# Altium schematic sheet S07.SchDoc: Quad Linear Amplifier
size 381 x 254 mm; Revision: 1.6; SheetNumber: 7; SheetTotal: 9
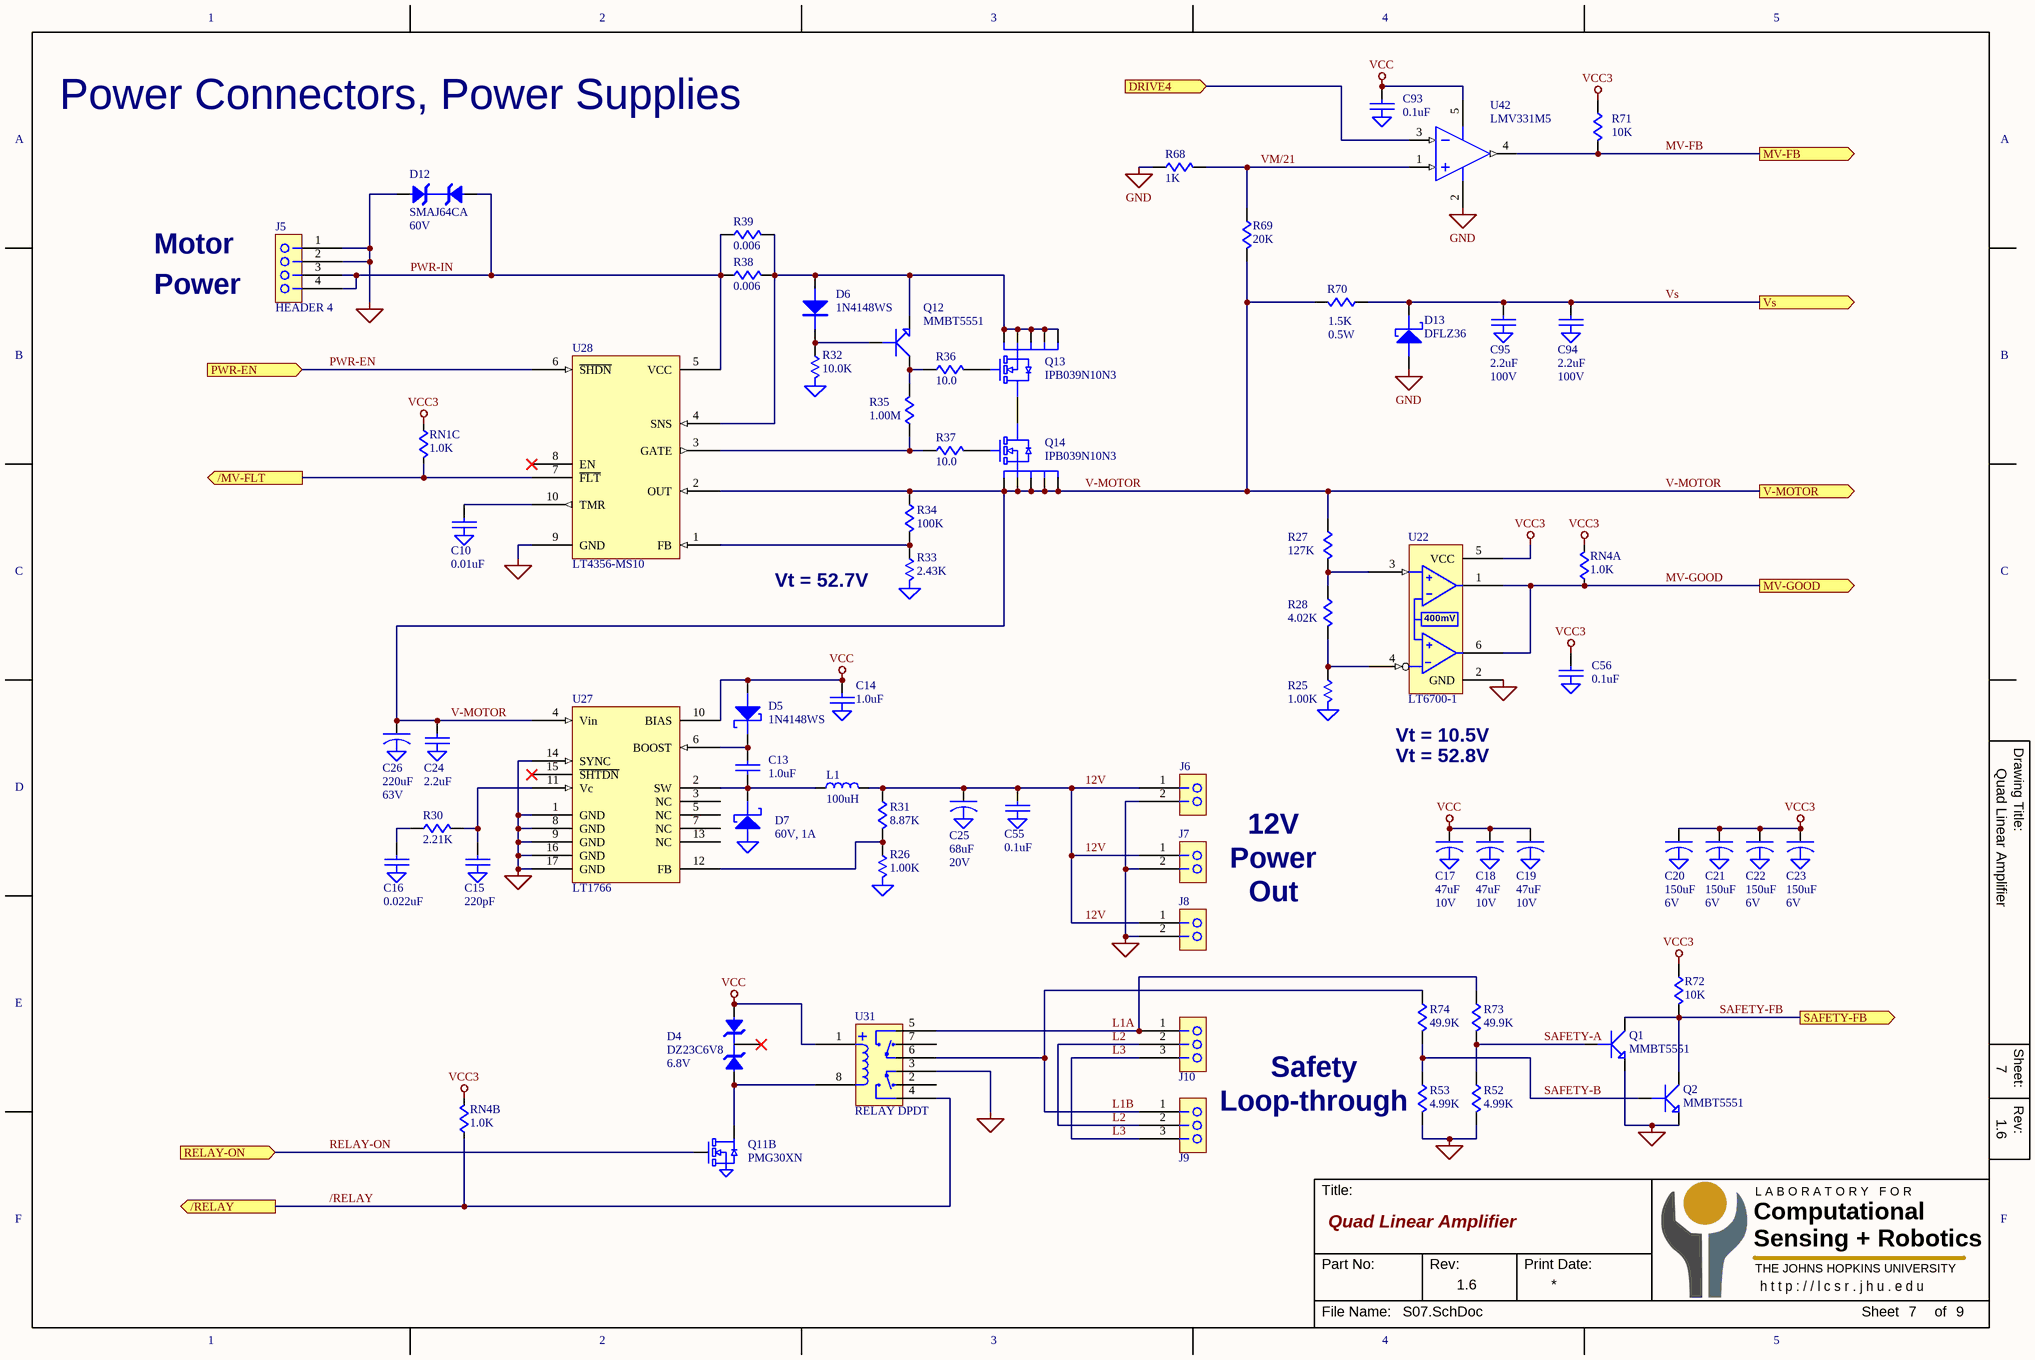
[diagram p0: S07.SchDoc]

## Parts
C10  0.01uF  [C0603]
C13  1.0uF  [C0603]
C14  1.0uF  [C0603]
C15  220pF  [C0603]
C16  0.022uF  [C0603]
C17  47uF  Voltage: 10V  [CAP-B]
C18  47uF  Voltage: 10V  [CAP-B]
C19  47uF  Voltage: 10V  [CAP-B]
C20  150uF  Voltage: 6V  [CAP-B]
C21  150uF  Voltage: 6V  [CAP-B]
C22  150uF  Voltage: 6V  [CAP-B]
C23  150uF  Voltage: 6V  [CAP-B]
C24  2.2uF  [C1206]
C25  68uF  Voltage: 20V  [CAP-D-43]
C26  220uF  Voltage: 63V  [CAP-10MM]
C55  0.1uF  [C0603]
C56  0.1uF  [C0603]
C93  0.1uF  [C0603]
C94  2.2uF  Voltage: 100V  [C1206]
C95  2.2uF  Voltage: 100V  [C1206]
D4  DZ23C6V8  Voltage: 6.8V  [SOT-23]
D5  1N4148WS  [SOD-323]
D6  1N4148WS  [SOD-323]
D7  60V, 1A  [SMP]
D12  SMAJ64CA  Voltage: 60V  [SMA]
D13  DFLZ36  [PowerDI-123]
J5  HEADER 4  [WM-BL381-4]
J6  HEADER 2  [HDR-2x1-100]  (value not drawn)
J7  HEADER 2  [HDR-2x1-100]  (value not drawn)
J8  HEADER 2  [HDR-2x1-100]  (value not drawn)
J9  HEADER 3  [HDR-3x1-100]  (value not drawn)
J10  HEADER 3  [HDR-3x1-100]  (value not drawn)
L1  100uH  [INDUCTOR-DR12x]
Q1  MMBT5551  [SOT-23]
Q2  MMBT5551  [SOT-23]
Q11  PMG30XN  [SC70-6]  (part B of 2)
Q12  MMBT5551  [SOT-23]
Q13  IPB039N10N3  [TO-263-7]
Q14  IPB039N10N3  [TO-263-7]
R25  1.00K  [R0603]
R26  1.00K  [R0603]
R27  127K  [R0603]
R28  4.02K  [R0603]
R30  2.21K  [R0603]
R31  8.87K  [R0603]
R32  10.0K  [R0603]
R33  2.43K  [R0603]
R34  100K  [R0603]
R35  1.00M  [R0603]
R36  10.0  [R0603]
R37  10.0  [R0603]
R38  0.006  [R2512]
R39  0.006  [R2512]
R52  4.99K  [R0603]
R53  4.99K  [R0603]
R68  1K  [R0603]
R69  20K  [R0603]
R70  1.5K  Power: 0.5W  [R0805]
R71  10K  [R0603]
R72  10K  [R0603]
R73  49.9K  [R0603]
R74  49.9K  [R0603]
RN1  1.0K  [RN-742C083]  (part C of 4)
RN4  1.0K  [RN-742C083]  (parts A,B of 4)
U22  LT6700-1  [SOT-23-6]
U27  LT1766  [TSSOP-17]
U28  LT4356-MS10  [MSOP-10]
U31  RELAY DPDT  [RELAY-IM03TS]
U42  LMV331M5  [SOT-23-5]

## Ports
/MV-FLT (out), /RELAY (out), DRIVE4 (in), MV-FB (out), MV-GOOD (out), PWR-EN (in), RELAY-ON (in), SAFETY-FB (out), V-MOTOR (out), Vs (out)

## Nets
GND: C10.2(GND) C14.2(GND) C15.2(GND) C16.2(GND) C17.2(GND) C18.2(GND) C19.2(GND) C20.2(GND) C21.2(GND) C22.2(GND) C23.2(GND) C24.2(GND) C25.2(GND) C26.2(GND) C55.2(GND) C56.2(GND) C93.2(GND) C94.2(GND) C95.2(GND) D7.2(ANODE) D12.2(A1) D13.2(ANODE) J5.1 J5.2 J6.2 J7.2 J8.2 Q1.2(E) Q2.2(E) Q11.4(S2) R25.2(GND) R26.2(GND) R32.2(GND) R33.2(GND) R52.2 R53.2 R68.1 U22.2(GND) U27.1(GND) U27.8(GND) U27.9(GND) U27.14(SYNC) U27.16(GND) U27.17(GND) U28.9(GND) U31.3(COM) U42.2(V-)
VCC: C14.1 C17.1 C18.1 C19.1 C93.1 D4.2(A1) D5.2(ANODE) U27.10(BIAS) U31.1(COIL+) U42.5(V+)
VCC3: C20.1 C21.1 C22.1 C23.1 C56.1 R71.1 R72.1 RN1.3 RN4.7 RN4.8 U22.5(VCC)
12V: C25.1 C55.1 J6.1 J7.1 J8.1 L1.2 R31.1
/MV-FLT: RN1.6 U28.7(~{FLT}) ; port /MV-FLT
/RELAY: RN4.2 U31.4(NO) ; port /RELAY
DRIVE4: U42.3(IN-) ; port DRIVE4
L1A: J10.1 R73.1 U31.5(NO)
L1B: J9.1 R74.1 U31.6(COM)
L2: J9.2 J10.2
L3: J9.3 J10.3
MV-FB: R71.2 U42.4(OUT) ; port MV-FB
MV-GOOD: RN4.1 U22.1(OUTA) U22.6(OUTB) ; port MV-GOOD
PWR-EN: U28.6(~{SHDN}) ; port PWR-EN
PWR-IN: D12.1(A2) J5.3 J5.4 R38.1 R39.1 U28.5(VCC)
RELAY-ON: Q11.5(G2) ; port RELAY-ON
SAFETY-A: Q1.1(B) R52.1 R73.2
SAFETY-B: Q2.1(B) R53.1 R74.2
SAFETY-FB: Q1.3(C) Q2.3(C) R72.2 ; port SAFETY-FB
V-MOTOR: C24.1 C26.1 Q14.2(S) Q14.3(S) Q14.5(S) Q14.6(S) Q14.7(S) R27.1 R34.1 R69.2 R70.2 U27.4(Vin) U28.2(OUT) ; port V-MOTOR
VM/21: R68.2 R69.1 U42.1(IN+)
Vs: C94.1 C95.1 D13.1(CATHODE) R70.1 ; port Vs
NetC10_1: C10.1 U28.10(TMR)
NetC13_1: C13.1 D5.1(CATHODE) U27.6(BOOST)
NetC13_2: C13.2 D7.1(CATHODE) L1.1 U27.2(SW)
NetC15_1: C15.1 R30.2 U27.11(Vc)
NetC16_1: C16.1 R30.1
NetD4_1: D4.1(A2) Q11.3(D2) U31.8(COIL-)
NetD6_1: D6.1(C) Q12.1(B) R32.1
NetD6_2: D6.2(A) Q12.2(E) Q13.2(S) Q13.3(S) Q13.5(S) Q13.6(S) Q13.7(S) R38.2 R39.2 U28.4(SNS)
NetQ12_3: Q12.3(C) R35.2 R36.1
NetQ13_1: Q13.1(G) R36.2
NetQ13_4: Q13.4(D) Q14.4(D)
NetQ14_1: Q14.1(G) R37.2
NetR25_1: R25.1 R28.2 U22.4(INB)
NetR26_1: R26.1 R31.2 U27.12(FB)
NetR27_2: R27.2 R28.1 U22.3(INA)
NetR33_1: R33.1 R34.2 U28.1(FB)
NetR35_1: R35.1 R37.1 U28.3(GATE)

Not connected (* = marked no-connect by the designer): D4 3(A1)*; U27 3(NC) 5(NC) 7(NC) 13(NC) 15(~{SHTDN})*; U28 8(EN)*; U31 2(NC) 7(NC)

## Notes on the sheet
- Power Connectors, Power Supplies
- Motor
- Power
- Vt = 52.7V
- (near U22) Vt = 10.5V
- Vt = 52.8V
- 12V
- Out
- Safety
- (near R53) Loop-through
- SAFETY1-FB is high when L1A > 4.5V.  Voltage at L1A must be less than 52.8V
- 1
- 2
- 3
- 4
- 5
- A
- B
- C
- Drawing Title:
- D
- E
- Sheet:
- Rev:
- F
- Title:
- Computational
- Sensing + Robotics
- L A B O R A T O R Y   F O R
- Part No:
- Print Date:
- THE JOHNS HOPKINS UNIVERSITY
- h t t p : / / l c s r . j h u . e d u
- File Name:
- Sheet
- of
- (in symbol LT6700-SOT) 400mV

## Library data of the parts
C10 C14-C16 C24 C55 C56 C93-C95 = CAP-GND
C13 = CAP
C17-C23 C25 C26 = CAP-POL-GND
D4 = ZENER-DUAL-CC
D5 D6 D13 = DIODE
D7 = DIODE GND/A
D12 = ZENER-DUAL-TVS
L1 = INDUCTOR-MINI
Q1 Q2 Q12 = NPN-SM
Q11 = MOSFET-N-DUAL6
Q13 Q14 = MOSFET-N-TO263-7
R25 R26 R32 R33 = R-GND
R27 R28 R30 R31 R34-R39 R52 R53 R68-R74 = R
RN1 RN4 = RN-DISC-SM-4X
U22 = LT6700-SOT
U42 = LMV331: Comparator, SOT-23-5